# Altium schematic sheet Block Diagram of IR Sensor.SchDoc: BLOCK DIAGRAM
size 800 x 566 mm; Organization: ORGANIZATION; Address1: ADDRESS 1; Address2: ADDRESS 2; Address3: ADDRESS 3; Address4: ADDRESS 4; Revision: -; SheetNumber: 1; SheetTotal: 3; Project: IR SENSOR; ENG_APP_DATE: --/--/--; DSN_APP_DATE: --/--/--; CHK_APP_DATE: --/--/--; Version: 1
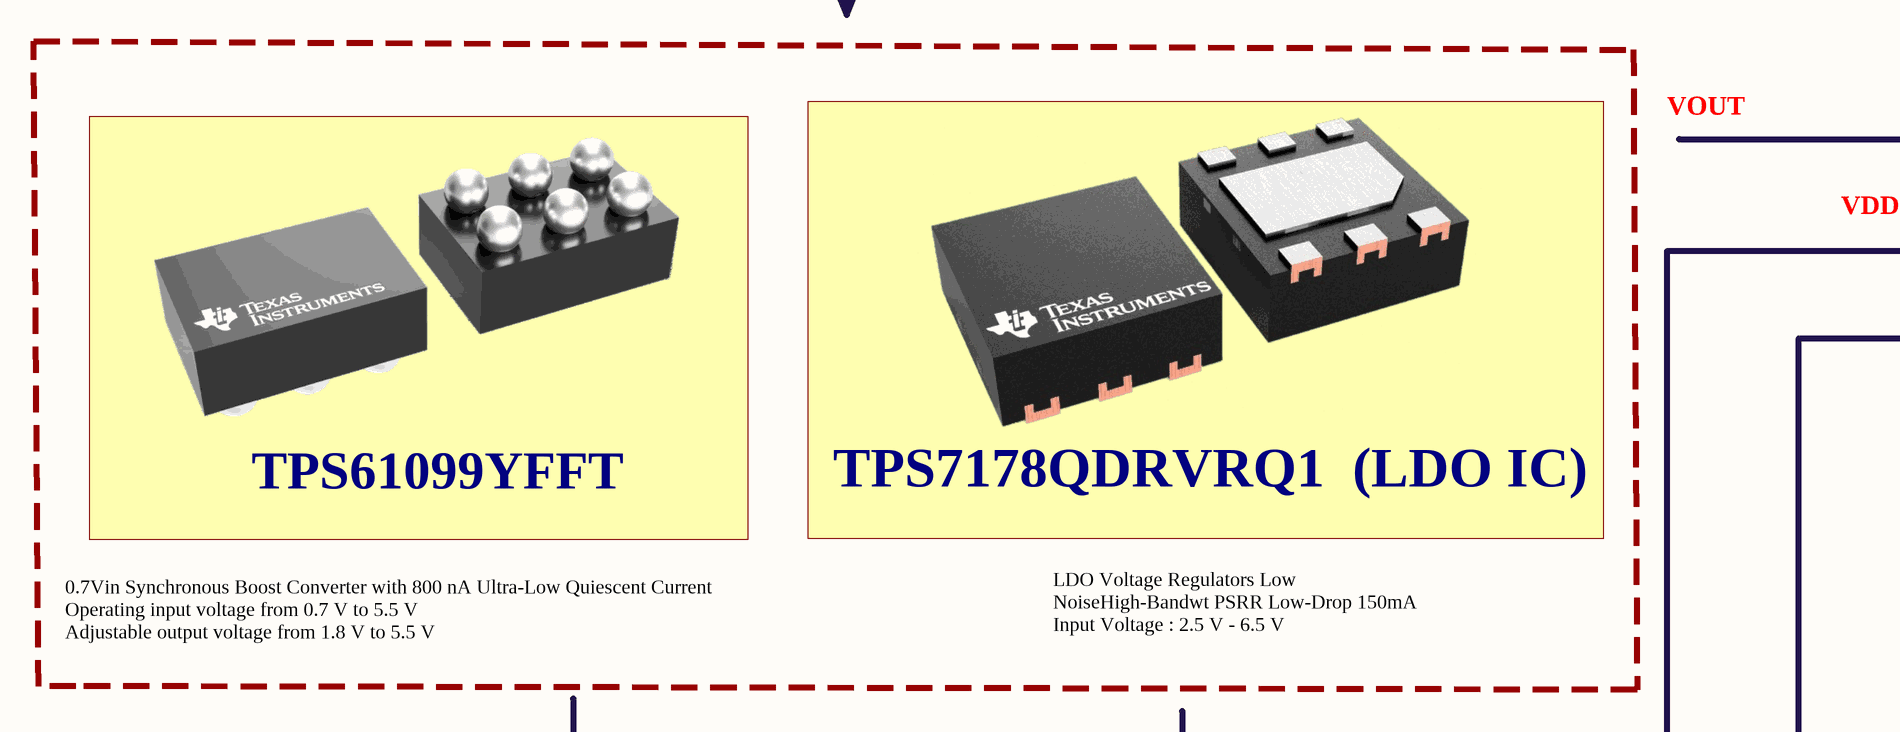
[diagram p0: Block Diagram of IR Sensor.SchDoc, top left]
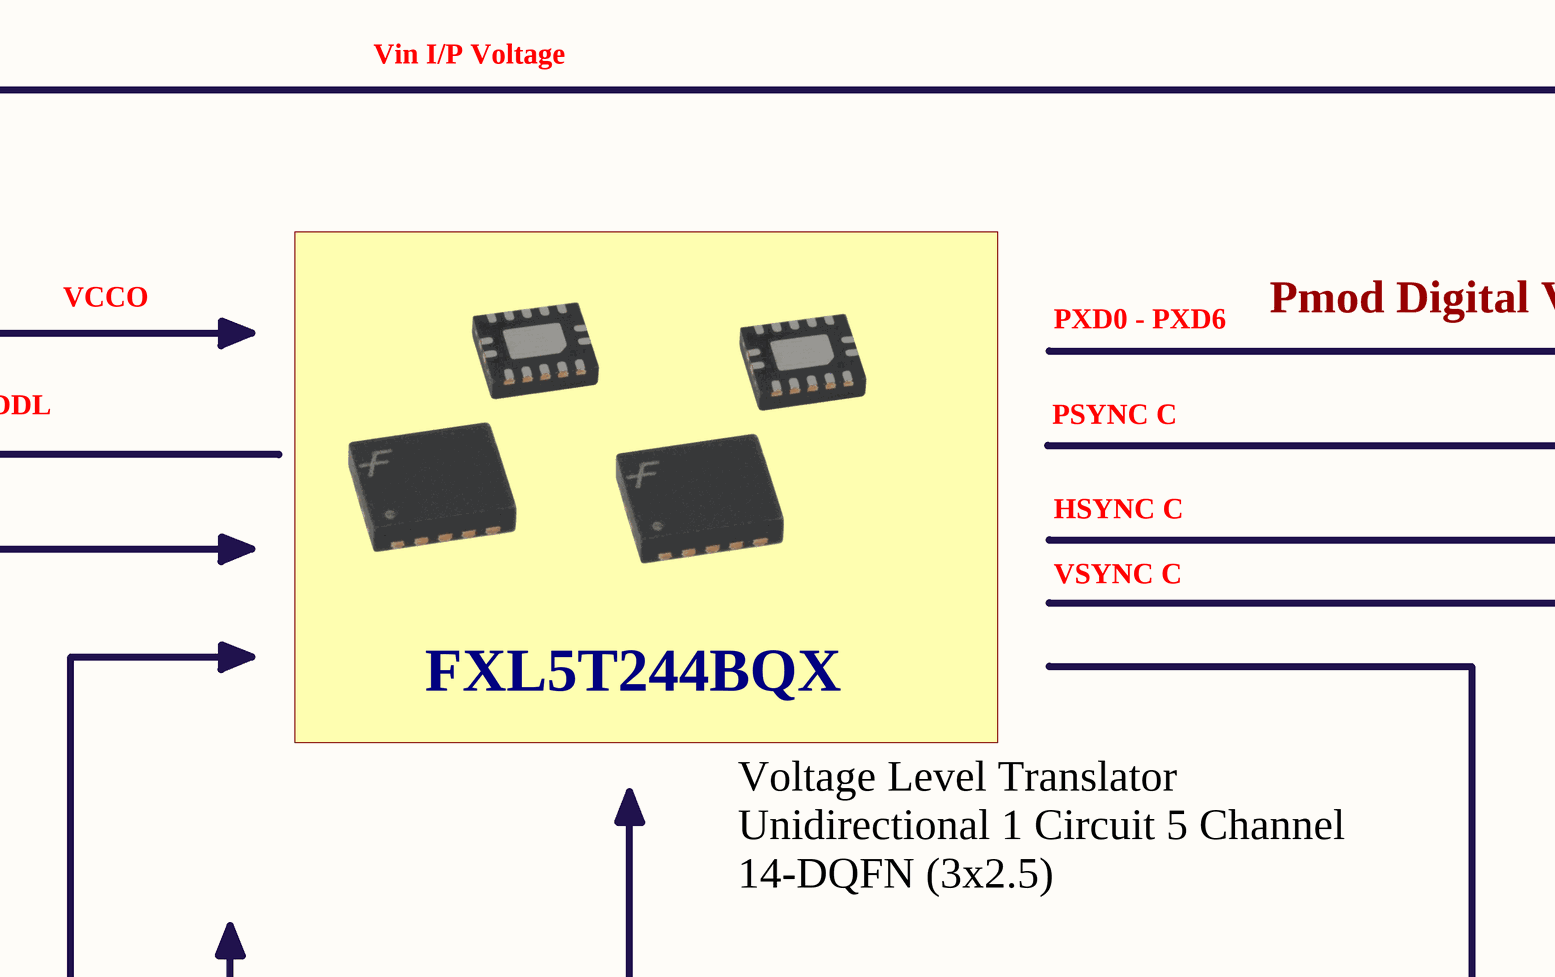
[diagram p1: Block Diagram of IR Sensor.SchDoc, top right]
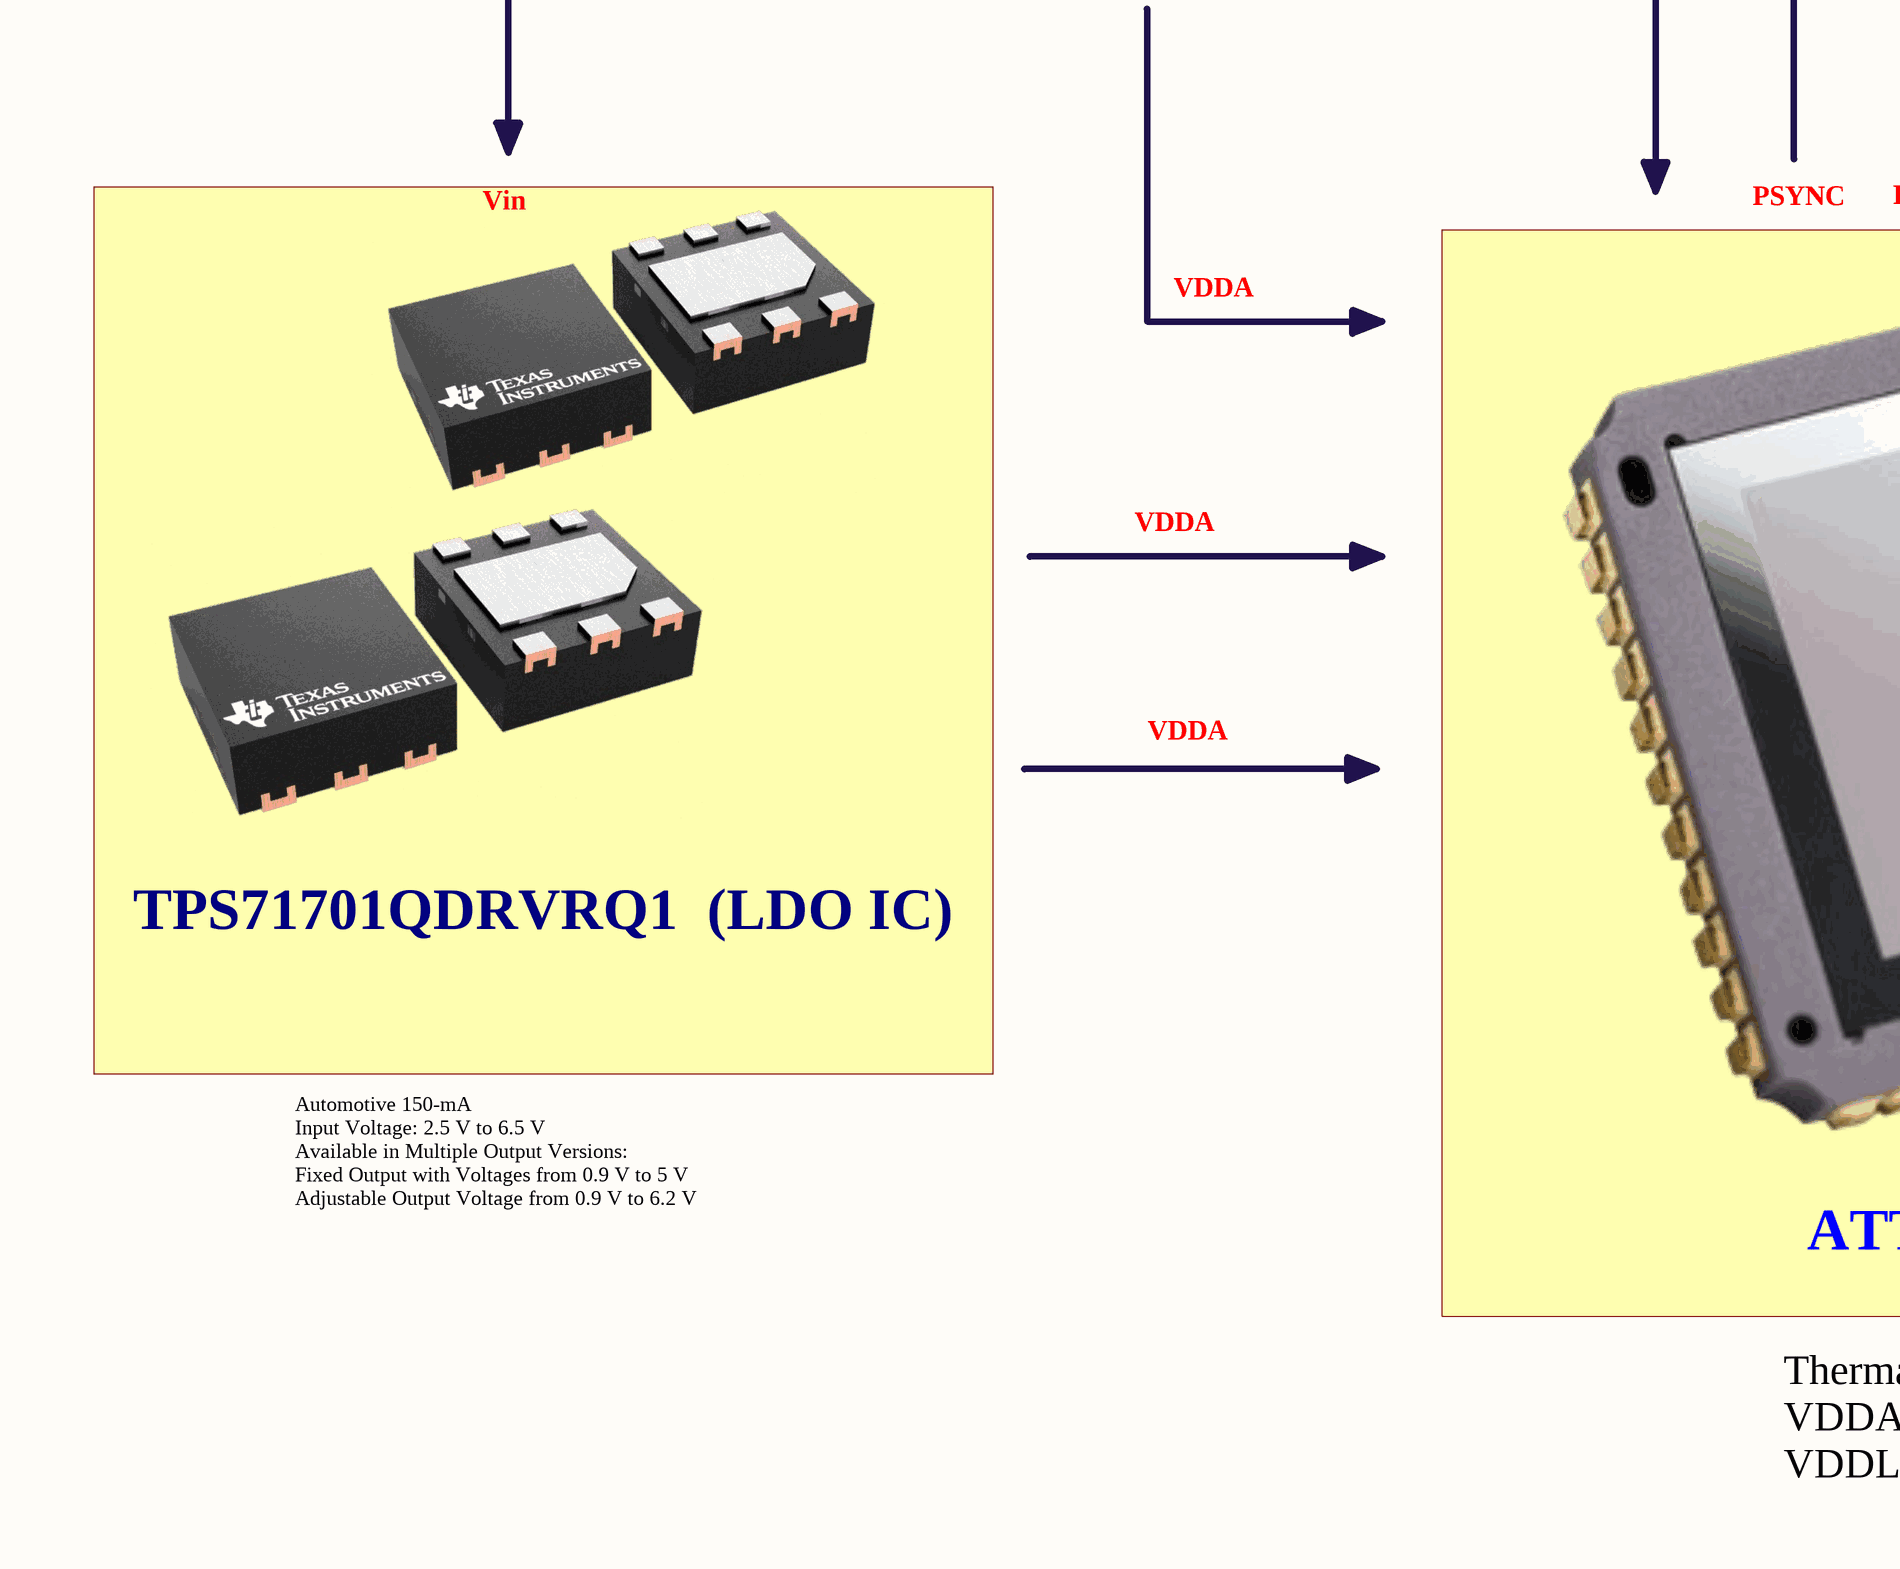
[diagram p2: Block Diagram of IR Sensor.SchDoc, bottom left]
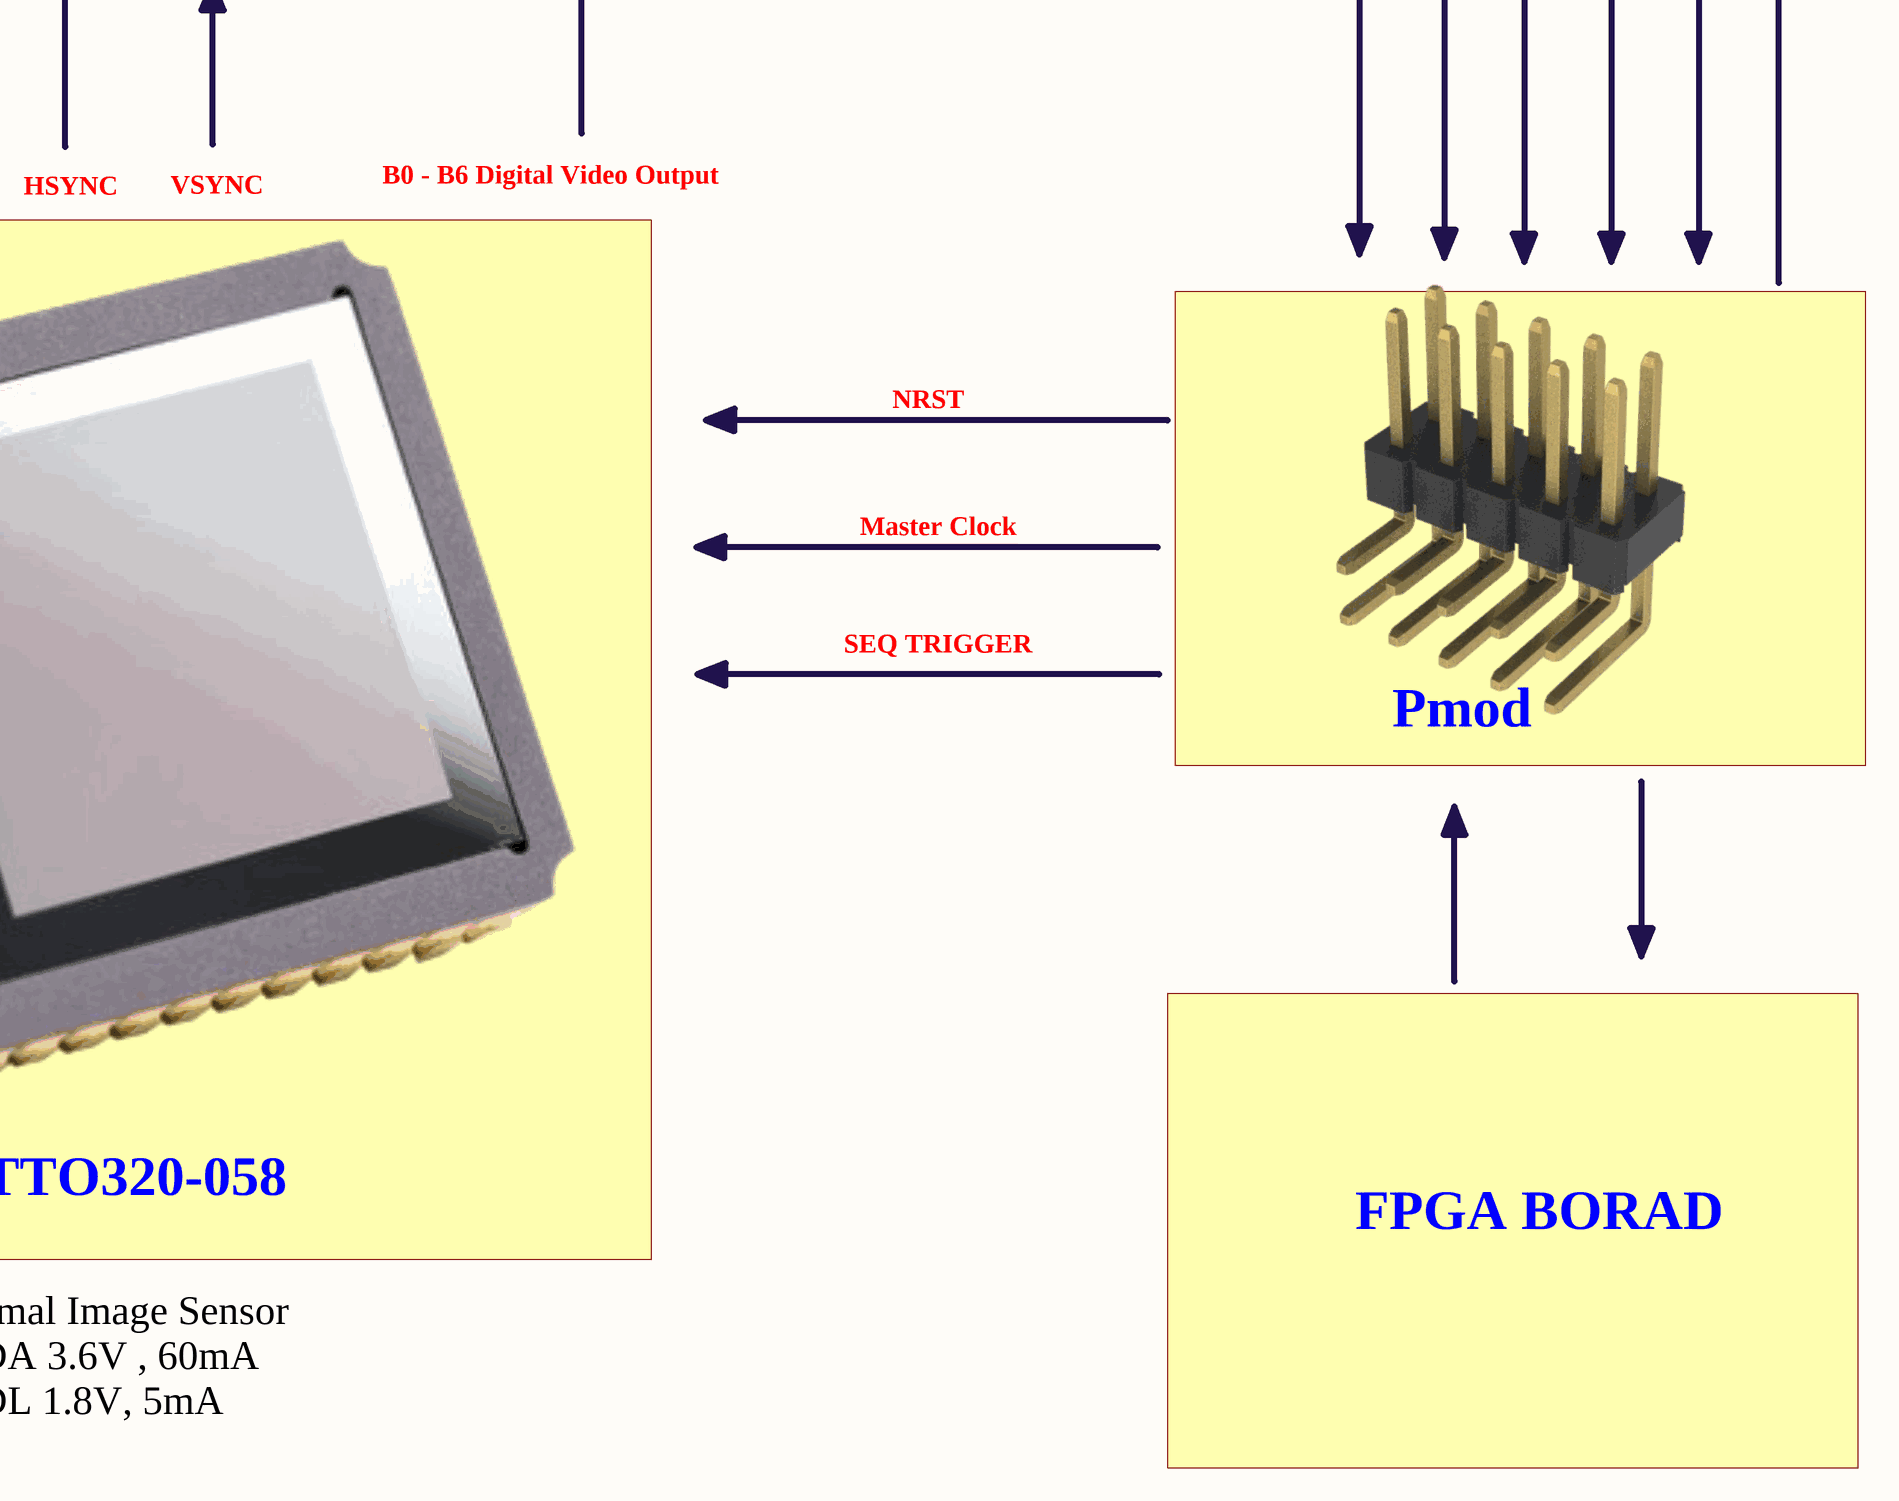
[diagram p3: Block Diagram of IR Sensor.SchDoc, bottom right]

## Notes on the sheet
- Vin I/P Voltage
- VOUT
- VCCO
- Pmod Digital Video Interface
- PXD0 - PXD6
- VDDL
- PSYNC C
- HSYNC C
- VSYNC C
- I2C INTERFACE
- TPS61099YFFT
- TPS7178QDRVRQ1  (LDO IC)
- FXL5T244BQX
- 0.7Vin Synchronous Boost Converter with 800 nA Ultra-Low Quiescent Current                                            Operating input voltage from 0.7 V to 5.5 V
  Adjustable output voltage from 1.8 V to 5.5 V
- LDO Voltage Regulators Low NoiseHigh-Bandwt PSRR Low-Drop 150mA                                               Input Voltage : 2.5 V - 6.5 V                                                      Output Voltage:	1.8 V                                 Output Current:	150 mA
- Voltage Level Translator Unidirectional 1 Circuit 5 Channel 14-DQFN (3x2.5)
- Vin
- PSYNC
- HSYNC
- B0 - B6
- VSYNC
- B0 - B6 Digital Video Output
- VDDA
- NRST
- Master Clock
- SEQ TRIGGER
- Pmod
- TPS71701QDRVRQ1  (LDO IC)
- Automotive 150-mA                                                 Input Voltage: 2.5 V to 6.5 V                                           Available in Multiple Output Versions:
  Fixed Output with Voltages from 0.9 V to 5 V
  Adjustable Output Voltage from 0.9 V to 6.2 V
- ATTO320-058
- FPGA BORAD
- Thermal Image Sensor                                                   VDDA 3.6V , 60mA                                                                VDDL 1.8V, 5mA
- TITLE :-
- VERSION :-
- PROJECT :-
- SHEET :-
- REVISION:-
- OF
- CONFIDENTIAL
- DATE :-